# EAGLE design lorasch (EAGLE 9.5.2)
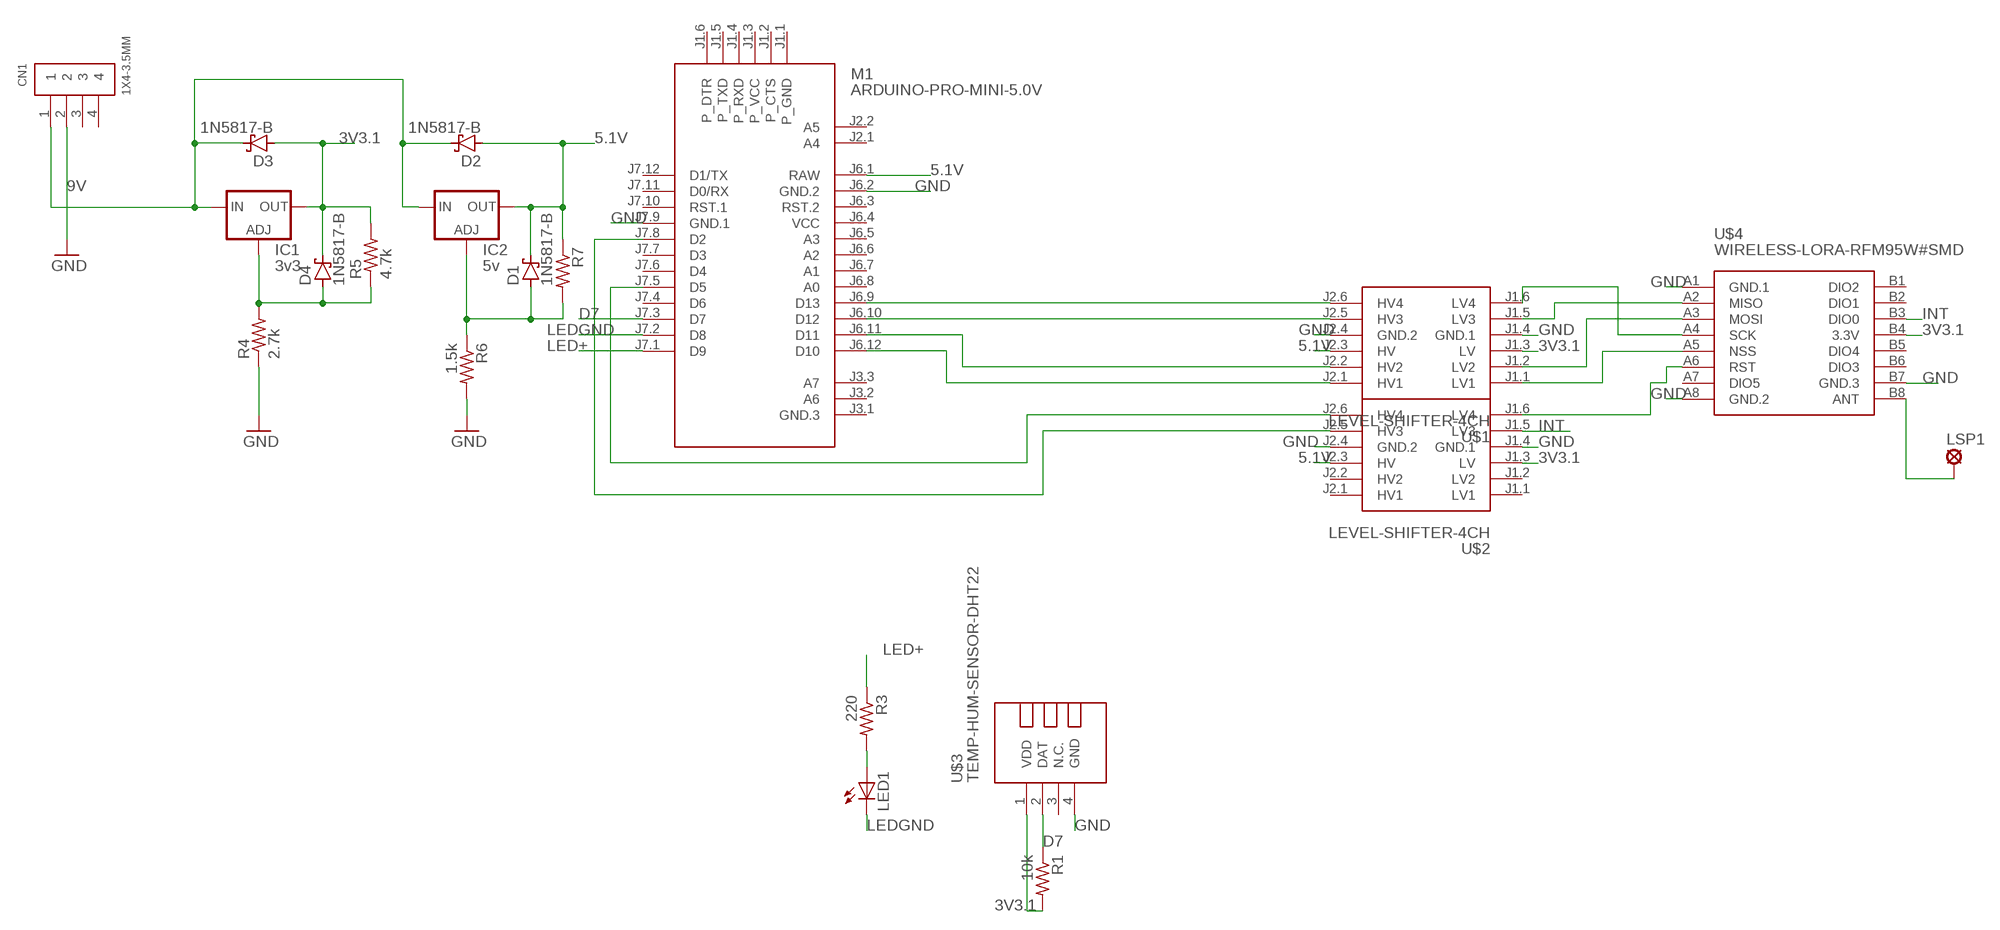
[diagram p0: schematic, sheet 1]

## Parts
CN1  1X4-3.5MM  [1X04-3.5MM]
D1  1N5817-B  [DO41-7.6]
D2  1N5817-B  [DO41-7.6]
D3  1N5817-B  [DO41-7.6]
D4  1N5817-B  [DO41-7.6]
IC1  3v3  LM317TL  [317TL]
IC2  5v  LM317TL  [317TL]
LED1  LED5MM  [LED5MM]
LSP1  SE14  [SE14]
M1  ARDUINO-PRO-MINI-5.0V  [ARDUINO-PRO-MINI]
R1  10k  R-US_0204/7  [0204/7]
R3  220  R-US_0204/7  [0204/7]
R4  2.7k  R-US_0204/7  [0204/7]
R5  4.7k  R-US_0204/7  [0204/7]
R6  1.5k  R-US_0204/7  [0204/7]
R7  R-US_0204/7  [0204/7]
U$1  LEVEL-SHIFTER-4CH  [LEVEL-SHIFTER-4CH]
U$2  LEVEL-SHIFTER-4CH  [LEVEL-SHIFTER-4CH]
U$3  TEMP-HUM-SENSOR-DHT22  [TEMP-HUM-SENSOR-DHT22]
U$4  WIRELESS-LORA-RFM95W#SMD  [WIRELESS-LORA-RFM95W#SMD]

## Nets
3V3.1: D3.A D4.C IC1.2(OUT) R1.2 R5.2 U$1.J1.3(LV) U$2.J1.3(LV) U$3.1(VDD) U$4.B4(3.3V)
5.1V: D1.C D2.A IC2.2(OUT) M1.J6.1(RAW) R7.1 U$1.J2.3(HV) U$2.J2.3(HV)
9V: CN1.1 D2.C D3.C IC1.3(IN) IC2.3(IN)
D7: M1.J7.3(D7) R1.1 U$3.2(DAT)
GND: CN1.2 M1.J6.2(GND.2) M1.J7.9(GND.1) R4.1 R6.2 U$1.J1.4(GND.1) U$1.J2.4(GND.2) U$2.J1.4(GND.1) U$2.J2.4(GND.2) U$3.4(GND) U$4.A1(GND.1) U$4.A8(GND.2) U$4.B7(GND.3)
INT: U$2.J1.5(LV3) U$4.B3(DIO0)
LED+: M1.J7.1(D9) R3.1
LEDGND: LED1.K(C) M1.J7.2(D8)
N$1: D4.A IC1.1(ADJ) R4.2 R5.1
N$2: LED1.A R3.2
N$3: M1.J6.10(D12) U$1.J2.5(HV3)
N$4: M1.J6.11(D11) U$1.J2.2(HV2)
N$5: D1.A IC2.1(ADJ) R6.1 R7.2
N$7: M1.J6.12(D10) U$1.J2.1(HV1)
N$8: M1.J7.5(D5) U$2.J2.6(HV4)
N$9: M1.J7.8(D2) U$2.J2.5(HV3)
N$10: LSP1.MP U$4.B8(ANT)
N$11: U$1.J1.2(LV2) U$4.A3(MOSI)
N$12: U$1.J1.5(LV3) U$4.A2(MISO)
N$13: U$1.J1.6(LV4) U$4.A4(SCK)
N$14: M1.J6.9(D13) U$1.J2.6(HV4)
N$15: U$1.J1.1(LV1) U$4.A5(NSS)
N$17: U$2.J1.6(LV4) U$4.A6(RST)
Unconnected: CN1.3 CN1.4 M1.J1.1(P_GND) M1.J1.2(P_CTS) M1.J1.3(P_VCC) M1.J1.4(P_RXD) M1.J1.5(P_TXD) M1.J1.6(P_DTR) M1.J2.1(A4) M1.J2.2(A5) M1.J3.1(GND.3) M1.J3.2(A6) M1.J3.3(A7) M1.J6.3(RST.2) M1.J6.5(A3) M1.J6.6(A2) M1.J6.7(A1) M1.J6.8(A0) M1.J7.4(D6) M1.J7.6(D4) M1.J7.7(D3) M1.J7.10(RST.1) M1.J7.11(D0/RX) M1.J7.12(D1/TX) U$2.J1.1(LV1) U$2.J1.2(LV2) U$2.J2.1(HV1) U$2.J2.2(HV2) U$3.3(N.C.) U$4.A7(DIO5) U$4.B1(DIO2) U$4.B2(DIO1) U$4.B5(DIO4) U$4.B6(DIO3)

## Power pins joined to a net without a drawn wire
VCC: M1.J6.4(VCC)

## Library data of the parts
CN1 = adafruit:1X4: 4-pin connector
D1-D4 = diode:1N581*: 1.0A SCHOTTKY BARRIER RECTIFIER Source: http://www.diodes.com/datasheets/ds23001.pdf
IC1 IC2 = v-reg:LM317TL: VOLTAGE REGULATOR
LED1 = adafruit:LED: LED OSRAM: - CHIPLED LG R971, LG N971, LY N971, LG Q971, LY Q971, LO R971, LY R971 LH N974, LH R974 LS Q976, LO Q976, LY Q976 LO Q996 - Hyper CHIPLED LW Q18S LB Q993, LB Q99A, LB R99A - SideLED LS A670, LO A670, LY A670, LG A670, LP A670 LB A673, LV A673, LT A673, LW A673 LH A674 LY A675 LS A676, LA A676, LO A676, LY A676, LW A676 LS A679, LY A679, LG A679 - Hyper Micro SIDELED® LS Y876, LA Y876, LO Y876, LY Y876 LT Y87S - SmartLED LW L88C, LW L88S LB L89C, LB L89S, LG L890 LS L89K, LO L89K, LY L89K LS L896, LA L896, LO L896, LY L896 - TOPLED LS T670, LO T670, LY T670, LG T670, LP T670 LSG T670, LSP T670, LSY T670, LOP T670, LYG T670 LG T671, LOG T671, LSG T671 LB T673, LV T673, LT T673, LW T673 LH T674 LS T676, LA T676, LO T676, LY T676, LB T676, LH T676, LSB T676, LW T676 LB T67C, LV T67C, LT T67C, LS T67K, LO T67K, LY T67K, LW E67C LS E67B, LA E67B, LO E67B, LY E67B, LB E67C, LV E67C, LT E67C LW T67C LS T679, LY T679, LG T679 LS T770, LO T770, LY T770, LG T770, LP T770 LB T773, LV T773, LT T773, LW T773 LH T774 LS E675, LA E675, LY E675, LS T675 LS T776, LA T776, LO T776, LY T776, LB T776 LHGB T686 LT T68C, LB T68C - Hyper Mini TOPLED® LB M676 - Mini TOPLED Santana® LG M470 LS M47K, LO M47K, LY M47K Source: http://www.osram.convergy.de/
LSP1 = solpad:SE14: SOLDER PAD E1553, drill 1,4mm, distributor Buerklin, 07F820
M1 = dht22:ARDUINO-PRO-MINI-*: Arduino Pro Mini and compatible devices More details available here: https://www.arduino.cc/en/Main/ArduinoBoardProMini Click here to find device on ebay.com <http://www.ebay.com/sch/arduino+pro+mini>
R1 R3-R7 = adafruit:R-US_: RESISTOR, American symbol
U$1 U$2 = dht22:LEVEL-SHIFTER-4CH: 4-Channel Bi-Directional Logic Level Converter based on BSS128 transistors Click here to find device on ebay.com <http://www.ebay.com/sch/i2c+logic+converter+module>
U$3 = dht22:TEMP-HUM-SENSOR-DHT22: DHT22 - digital humidity & temperature sensor Also known as: AM2302 AM2302 datasheet available here: http://akizukidenshi.com/download/ds/aosong/AM2302.pdf Click here to find device on ebay.com <http://www.ebay.com/sch/dht22+digital+sensor>
U$4 = dht22:WIRELESS-LORA-RFM95W: 868/915 MHz LoRa Radio Transceiver Module based on SX1276 chip Click here to find device on ebay.com <http://www.ebay.com/sch/RFM95W+transceiver>

## Board
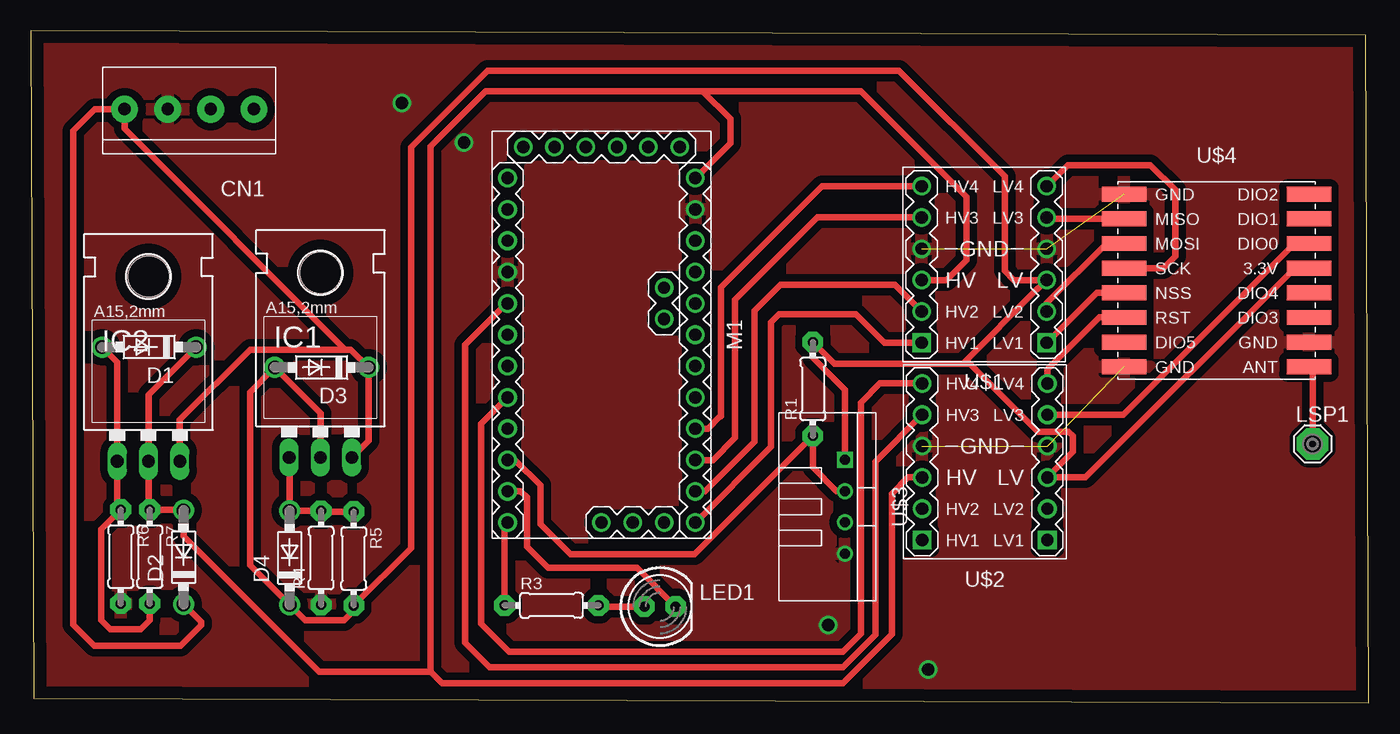
[diagram p1: board, top side]
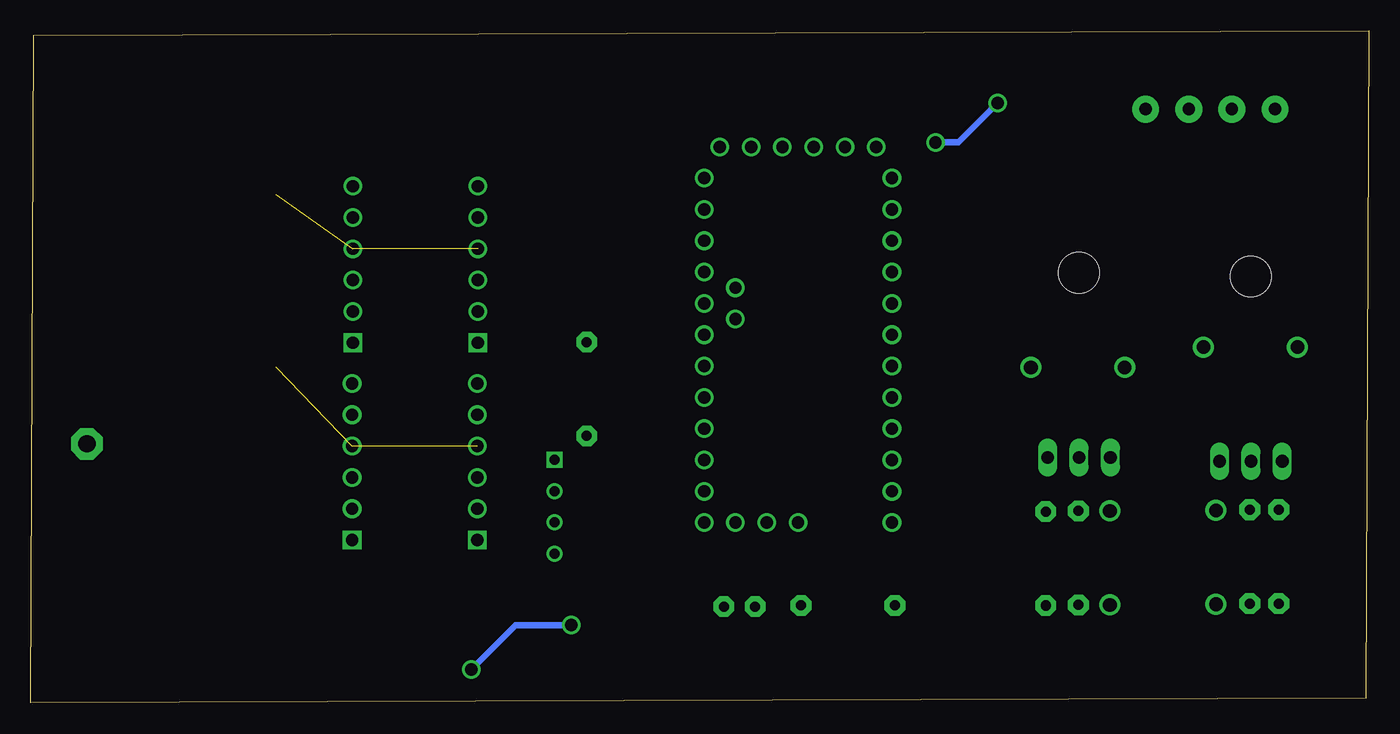
[diagram p2: board, bottom side, seen from below]

Size 108.55 x 54.5 mm. Coordinates in mm from the lower left corner, seen from the top.
Outline: 0.25,0.35 108.55,0 108.3,54.15 0,54.5 0.25,0.35
Copper layers (1*16): Top 0.035mm / dielectric 1.5mm / Bottom 0.035mm
Design rules "default": minimum track width 6mil, minimum drill 0.35mm, track to track 6mil, track to pad 6mil, pad to pad 6mil, via to via 6mil, smd to smd 6mil, copper to edge 40mil, drill to drill 6mil, minimum pad ring 10mil, minimum via ring 8mil, stop-mask expansion 4mil, vias tented up to drill 0mil, thermal gap 10mil

### Footprints (pad centres in the part's own frame; a part is rotated, then mirrored left to right if it is on the bottom)
1X04-3.5MM = drill 1 pad 2.184: 1 -5.25,0; 2 -1.75,0; 3 1.75,0; 4 5.25,0
DO41-7.6 = drill 1.1 pad 1.7: A 3.81,0; C -3.81,0
317TL = drill 1.016 long: 1 -2.54,-3.81; 2 0,-3.81; 3 2.54,-3.81 | hole 3.302: 0,11.176
LED5MM = drill 0.813 pad 1.676 octagon: A -1.27,0; K 1.27,0
SE14 = drill 1.397 pad 2.54 octagon: MP 0,0
ARDUINO-PRO-MINI = drill 1: J1.1 -15.24,6.35; J1.2 -15.24,3.81; J1.3 -15.24,1.27; J1.4 -15.24,-1.27; J1.5 -15.24,-3.81; J1.6 -15.24,-6.35; J2.1 -1.27,5.08; J2.2 -3.81,5.08; J3.1 15.24,0; J3.2 15.24,2.54; J3.3 15.24,5.08; J6.1 -12.7,7.62; J6.2 -10.16,7.62; J6.3 -7.62,7.62; J6.4 -5.08,7.62; J6.5 -2.54,7.62; J6.6 0,7.62; J6.7 2.54,7.62; J6.8 5.08,7.62; J6.9 7.62,7.62; J6.10 10.16,7.62; J6.11 12.7,7.62; J6.12 15.24,7.62; J7.1 15.24,-7.62; J7.2 12.7,-7.62; J7.3 10.16,-7.62; J7.4 7.62,-7.62; J7.5 5.08,-7.62; J7.6 2.54,-7.62; J7.7 0,-7.62; J7.8 -2.54,-7.62; J7.9 -5.08,-7.62; J7.10 -7.62,-7.62; J7.11 -10.16,-7.62; J7.12 -12.7,-7.62
0204/7 = drill 0.813 pad 1.676 octagon: 1 -3.81,0; 2 3.81,0
LEVEL-SHIFTER-4CH = drill 1 square: J1.1 -5.08,6.35; J2.1 5.08,6.35 | drill 1: J1.2 -5.08,3.81; J1.3 -5.08,1.27; J1.4 -5.08,-1.27; J1.5 -5.08,-3.81; J1.6 -5.08,-6.35; J2.2 5.08,3.81; J2.3 5.08,1.27; J2.4 5.08,-1.27; J2.5 5.08,-3.81; J2.6 5.08,-6.35
TEMP-HUM-SENSOR-DHT22 = drill 0.8 square: 1 -3.81,0 | drill 0.8: 2 -1.27,0; 3 1.27,0; 4 3.81,0
WIRELESS-LORA-RFM95W#SMD = smd 3.6 x 1.2: A1 -7.5,7; A2 -7.5,5; A3 -7.5,3; A4 -7.5,1; A5 -7.5,-1; A6 -7.5,-3; A7 -7.5,-5; A8 -7.5,-7; B1 7.5,7; B2 7.5,5; B3 7.5,3; B4 7.5,1; B5 7.5,-1; B6 7.5,-3; B7 7.5,-5; B8 7.5,-7

### Placement (x,y rotation side)
CN1  12.85,48.15 0 top
D1  9.6,28.85 180 top
D2  12.4,11.8 90 top
D3  23.6,27.2 180 top
D4  21,11.75 90 top
IC1  23.5,23.7 0 top
IC2  9.55,23.4 0 top
LED1  51.05,7.8 0 top
LSP1  104,21 0 top
M1  46.3,29.85 270 top
R1  63.45,25.45 90 top
R3  42.25,7.9 0 top
R4  23.55,11.75 90 top
R5  26.2,11.7 270 top
R6  7.3,11.85 270 top
R7  9.65,11.85 270 top
U$1  77.35,35.55 180 top
U$2  77.4,19.55 180 top
U$3  66.05,15.9 270 top
U$4  96.2,34.25 0 top

### Tracks (layer width: path | path; a pad name or v marks a point on that pad's centre or on a via)
3V3.1
  Top 0.508: IC1.2 23.5,23.49 D3.A 17.79,25.2 17.79,11.15 D4.C 22.25,6.69 25.42,6.69 26.2,7.48 R5.2 30.85,12.54 30.85,45.05 37.07,51.28 70.44,51.28 79.02,42.7 79.02,35.03 79.77,34.28 U$1.J1.3 81.71,33.56 81.68,33.56 75.62,27.51 | U$4.B4 102.55,35.25 85.58,18.28 U$2.J1.3 84.55,20.35 84.55,21.65 84.2,22 81.7,22 76.19,27.51 75.62,27.51 | 75.62,27.51 65.2,27.51 R1.2 63.45,28 66.05,25.4 U$3.1
5.1V
  Top 0.508: D1.C 9.55,24.99 IC2.2 9.55,15.76 R7.1 12.35,15.66 D2.A 12.4,13.51 23.41,2.5 32.45,2.5 | U$1.J2.3 74.28,34.28 75.9,35.9 75.9,41.05 67.35,49.6 54.5,49.6 | U$2.J2.3 71.18,18.28 69.85,16.95 69.85,5.55 65.9,1.6 33.35,1.6 32.45,2.5 | 32.45,2.5 32.45,45.15 36.9,49.6 54.5,49.6 | M1.J6.1 56.75,45.38 56.75,47.35 54.5,49.6
9V
  Top 0.508: IC1.3 27.41,21.26 D3.C 25.96,28.65 25.5,28.65 | IC2.3 12.09,22.94 17.8,28.65 25.5,28.65 | D2.C 13.81,6.58 13.81,6.28 12.16,4.64 5.14,4.64 3.44,6.34 3.44,46.39 5.2,48.15 CN1.1 7.6,46.55 25.5,28.65
D7
  Top 0.508: R1.1 63.58,21.51 | 63.57,21.52 R1.1 | U$3.2 65.38,17.17 63.45,19.1 R1.1 | R1.1 53.86,12.05 43.8,12.05 41.36,14.49 41.36,17.62 39.29,19.69 M1.J7.3
GND  (via drill 1)  (4 unrouted)
  Bottom 0.508: v35.15,45.45 33.3,45.45 v30.1,48.65 | v64.7,6.3 69.2,6.3 v72.8,2.7
  pour Top (isolate 0.61, rank 2): 0.1,-0.1 0.1,54.35 0.2,54.25 108.55,54.25 108.55,-0.1
INT
  Top 0.508: U$4.B3 102.52,37.25 88.63,23.36 U$2.J1.5
LED+
  Top 0.508: M1.J7.1 38.44,14.37 R3.1
LEDGND
  Top 0.508: LED1.K 49.17,10.95 41.95,10.95 40.25,12.65 40.25,16.65 39.75,17.15 M1.J7.2
N$1
  Top 0.508: IC1.1 21,19.85 D4.A R4.2 23.6,15.51 R5.1
N$2
  Top 0.508: LED1.A 46.16,7.8 R3.2
N$3
  Top 0.508: M1.J6.10 55.34,19.69 57.15,21.5 57.15,32.68 63.83,39.36 U$1.J2.5
N$4
  Top 0.508: M1.J6.11 54.68,17.15 58.71,21.18 58.71,31.81 60.81,33.91 70.1,33.91 U$1.J2.2
N$5
  Top 0.508: D1.A 7.01,27.63 IC2.1 7.01,15.95 R6.1 5.7,14.06 5.7,6.7 6.45,5.95 8.9,5.95 9.65,6.7 R7.2
N$7
  Top 0.508: M1.J6.12 60.05,20.75 60.05,30.88 60.68,31.51 66.97,31.51 69.27,29.2 U$1.J2.1
N$8
  Top 0.508: U$2.J2.6 68.9,25.9 67.35,24.35 67.35,5.6 65.9,4.15 38.8,4.15 36.55,6.4 36.55,22.64 M1.J7.5
N$9
  Top 0.508: U$2.J2.5 68.51,19.55 68.51,5.53 65.87,2.89 37.23,2.89 35.24,4.88 35.24,29.04 39,32.8 39,32.71 M1.J7.8
N$10
  Top 0.508: U$4.B8 104,27.55 LSP1.MP
N$11
  Top 0.508: U$4.A3 87.25,37.25 82.43,32.43 U$1.J1.2
N$12
  Top 0.508: U$4.A2 82.54,39.25 U$1.J1.5
N$13
  Top 0.508: U$4.A4 91.9,35.25 92.85,36.2 92.85,41.6 90.85,43.6 84.13,43.6 U$1.J1.6
N$14
  Top 0.508: U$1.J2.6 64.2,41.9 56,33.7 56,23.25 55.97,23.28 54.93,22.23 M1.J6.9
N$15
  Top 0.508: U$4.A5 86.48,33.25 U$1.J1.1
N$17
  Top 0.508: U$2.J1.6 82.48,27.05 86.68,31.25 U$4.A6